# EAGLE design front (EAGLE 6.2)
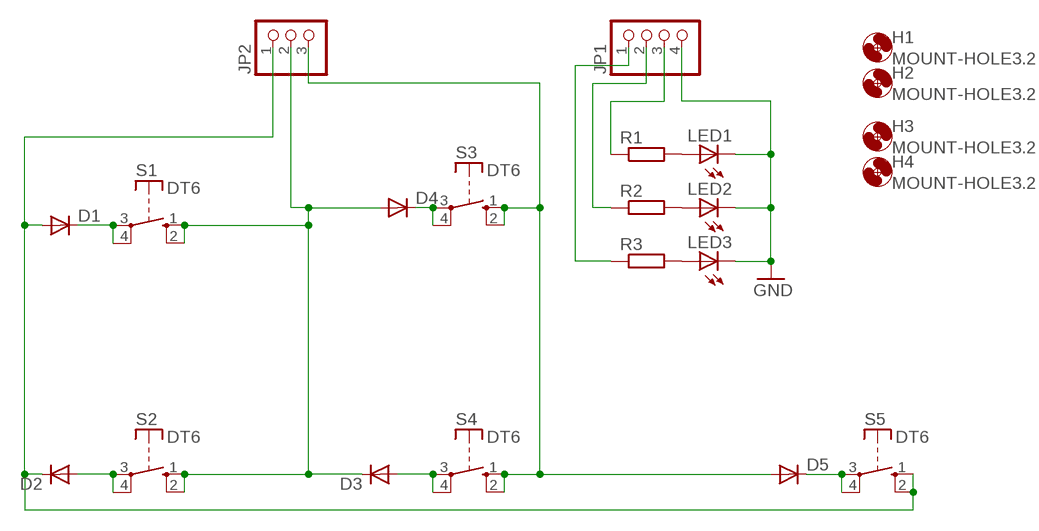
[diagram p0: schematic, sheet 1]

## Parts
D1  DIODE-MINIMELF  [MINIMELF]
D2  DIODE-MINIMELF  [MINIMELF]
D3  DIODE-MINIMELF  [MINIMELF]
D4  DIODE-MINIMELF  [MINIMELF]
D5  DIODE-MINIMELF  [MINIMELF]
H1  MOUNT-HOLE3.2  [3,2]
H2  MOUNT-HOLE3.2  [3,2]
H3  MOUNT-HOLE3.2  [3,2]
H4  MOUNT-HOLE3.2  [3,2]
JP1  PINHD-1X4  [1X04]
JP2  PINHD-1X3  [1X03]
LED1  LED3MM  [LED3MM]
LED2  LED3MM  [LED3MM]
LED3  LED3MM  [LED3MM]
R1  R-EU_R0805  [R0805]
R2  R-EU_R0805  [R0805]
R3  R-EU_R0805  [R0805]
S1  DT6  [DT6]
S2  DT6  [DT6]
S3  DT6  [DT6]
S4  DT6  [DT6]
S5  DT6  [DT6]

## Nets
GND: JP1.4 LED1.K(C) LED2.K(C) LED3.K(C)
N$1: LED1.A R1.2
N$2: LED2.A R2.2
N$3: LED3.A R3.2
N$4: JP1.3 R1.1
N$5: JP1.2 R2.1
N$6: JP1.1 R3.1
N$8: D1.C S1.3(P) S1.4(P)
N$9: D2.A S2.3(P) S2.4(P)
N$10: D4.C S3.3(P) S3.4(P)
N$11: D3.A S4.3(P) S4.4(P)
N$14: D3.C D4.A JP2.2 S1.1(S) S1.2(S) S2.1(S) S2.2(S)
N$15: D5.A JP2.3 S3.1(S) S3.2(S) S4.1(S) S4.2(S)
N$17: D1.A D2.C JP2.1 S5.1(S) S5.2(S)
N$18: D5.C S5.3(P) S5.4(P)

## Library data of the parts
D1-D5 = diode:DIODE-: DIODE
H1-H4 = holes:MOUNT-HOLE: MOUNTING HOLE with drill center marker
JP1 = pinhead:PINHD-1X4: PIN HEADER
JP2 = pinhead:PINHD-1X3: PIN HEADER
LED1-LED3 = led:LED: LED OSRAM: - CHIPLED LG R971, LG N971, LY N971, LG Q971, LY Q971, LO R971, LY R971 LH N974, LH R974 LS Q976, LO Q976, LY Q976 LO Q996 - Hyper CHIPLED LW Q18S LB Q993, LB Q99A, LB R99A - SideLED LS A670, LO A670, LY A670, LG A670, LP A670 LB A673, LV A673, LT A673, LW A673 LH A674 LY A675 LS A676, LA A676, LO A676, LY A676, LW A676 LS A679, LY A679, LG A679 - Hyper Micro SIDELED® LS Y876, LA Y876, LO Y876, LY Y876 LT Y87S - SmartLED LW L88C, LW L88S LB L89C, LB L89S, LG L890 LS L89K, LO L89K, LY L89K LS L896, LA L896, LO L896, LY L896 - TOPLED LS T670, LO T670, LY T670, LG T670, LP T670 LSG T670, LSP T670, LSY T670, LOP T670, LYG T670 LG T671, LOG T671, LSG T671 LB T673, LV T673, LT T673, LW T673 LH T674 LS T676, LA T676, LO T676, LY T676, LB T676, LH T676, LSB T676, LW T676 LB T67C, LV T67C, LT T67C, LS T67K, LO T67K, LY T67K, LW E67C LS E67B, LA E67B, LO E67B, LY E67B, LB E67C, LV E67C, LT E67C LW T67C LS T679, LY T679, LG T679 LS T770, LO T770, LY T770, LG T770, LP T770 LB T773, LV T773, LT T773, LW T773 LH T774 LS E675, LA E675, LY E675, LS T675 LS T776, LA T776, LO T776, LY T776, LB T776 LHGB T686 LT T68C, LB T68C - Hyper Mini TOPLED® LB M676 - Mini TOPLED Santana® LG M470 LS M47K, LO M47K, LY M47K Source: http://www.osram.convergy.de LUXEON: - LUMILED® LXK2-PW12-R00, LXK2-PW12-S00, LXK2-PW14-U00, LXK2-PW14-V00 LXK2-PM12-R00, LXK2-PM12-S00, LXK2-PM14-U00 LXK2-PE12-Q00, LXK2-PE12-R00, LXK2-PE12-S00, LXK2-PE14-T00, LXK2-PE14-U00 LXK2-PB12-K00, LXK2-PB12-L00, LXK2-PB12-M00, LXK2-PB14-N00, LXK2-PB14-P00, LXK2-PB14-Q00 LXK2-PR12-L00, LXK2-PR12-M00, LXK2-PR14-Q00, LXK2-PR14-R00 LXK2-PD12-Q00, LXK2-PD12-R00, LXK2-PD12-S00 LXK2-PH12-R00, LXK2-PH12-S00 LXK2-PL12-P00, LXK2-PL12-Q00, LXK2-PL12-R00 Source: www.luxeon.com KINGBRIGHT: KA-3528ASYC Source: www.kingbright.com
R1-R3 = rcl:R-EU_: RESISTOR, European symbol
S1-S5 = switch-misc:DT: ITT SWITCH

## Board
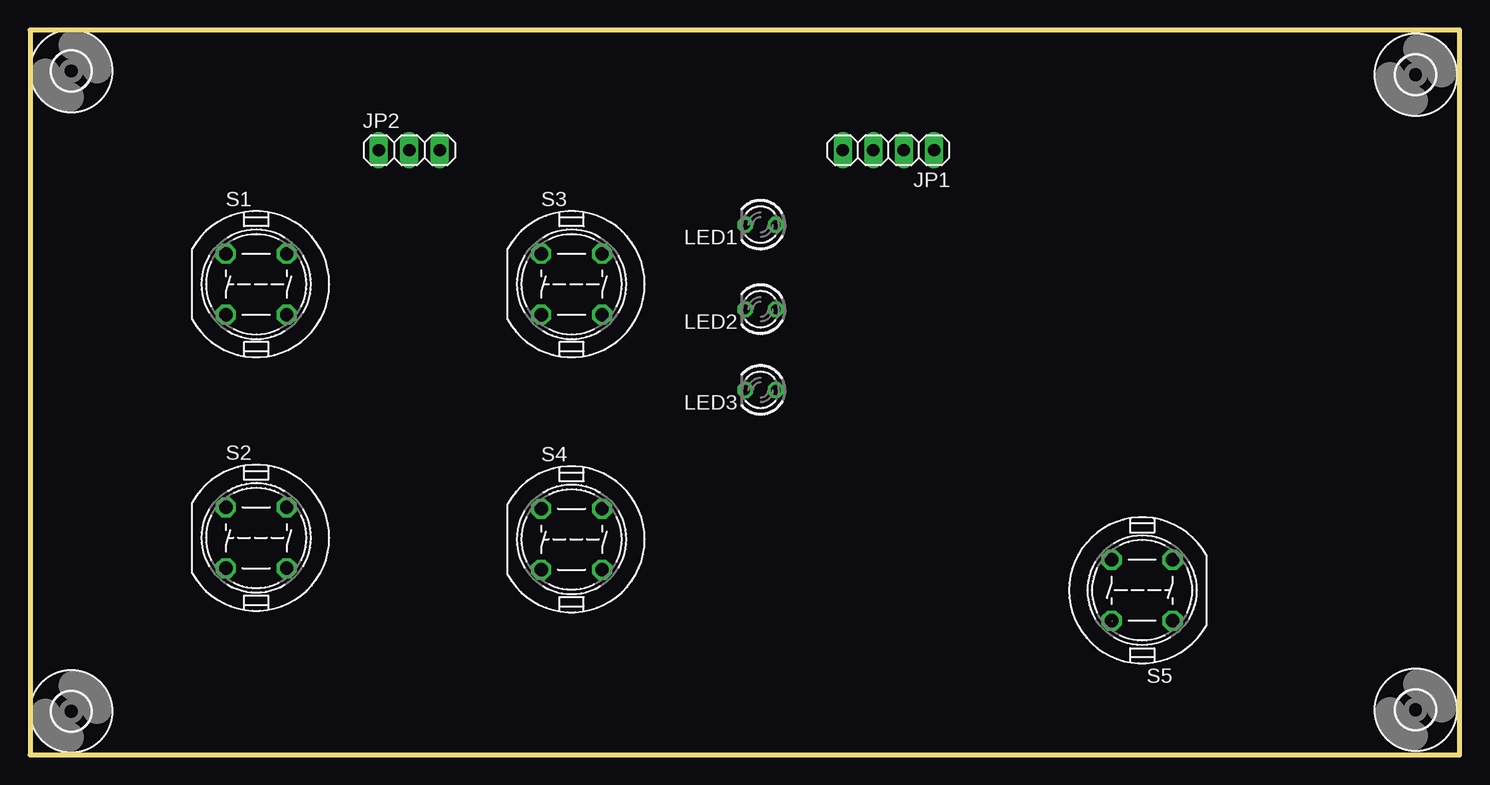
[diagram p1: board, top side]
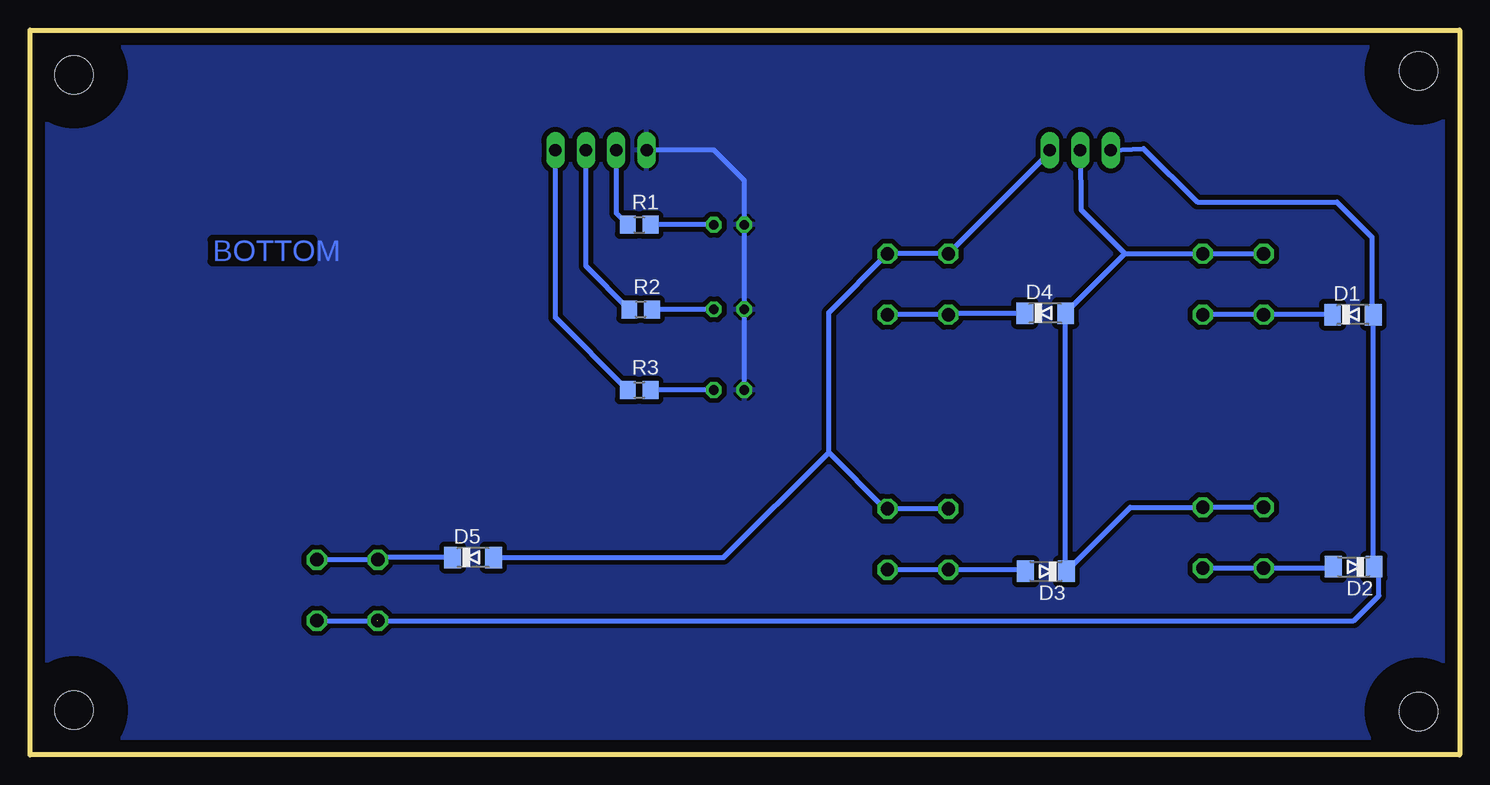
[diagram p2: board, bottom side, seen from below]

Size 119.17 x 60.44 mm. Coordinates in mm from the lower left corner, seen from the top.
Outline: 0,0 119.17,0 119.17,60.44 0,60.44 0,0
Copper layers (1*16): Top 0.035mm / dielectric 1.5mm / Bottom 0.035mm
Design rules "default": minimum track width 10mil, minimum drill 24mil, track to track 8mil, track to pad 8mil, pad to pad 8mil, via to via 8mil, smd to smd 8mil, copper to edge 40mil, drill to drill 8mil, minimum pad ring 10mil, minimum via ring 8mil, stop-mask expansion 4mil, vias tented up to drill 0mil, thermal gap 10mil

### Footprints (pad centres in the part's own frame; a part is rotated, then mirrored left to right if it is on the bottom)
MINIMELF = smd 1.4 x 1.8: A 1.7,0; C -1.7,0
3,2 = hole 3.2: 0,0
1X04 = drill 1.016 long: 1 -3.81,0; 2 -1.27,0; 3 1.27,0; 4 3.81,0
1X03 = drill 1.016 long: 1 -2.54,0; 2 0,0; 3 2.54,0
LED3MM = drill 0.813 octagon: A -1.27,0; K 1.27,0
R0805 = smd 1.3 x 1.5: 1 -0.95,0; 2 0.95,0
DT6 = drill 1.118 octagon: 1 -2.54,2.54; 2 2.54,2.54; 3 2.54,-2.54; 4 -2.54,-2.54

### Placement (x,y rotation side)
D1  8.89,36.7 0 bottom
D2  8.83,15.68 180 bottom
D3  34.48,15.3 180 bottom
D4  34.54,36.83 0 bottom
D5  82.23,16.45 0 bottom
H1  3.43,57.02 0 top
H2  3.43,3.62 0 top
H3  115.51,3.75 0 top
H4  115.51,56.71 0 top
JP1  71.56,50.42 180 top
JP2  31.62,50.42 0 top
LED1  60.9,44.2 180 top
LED2  60.9,37.15 180 top
LED3  60.9,30.42 180 top
R1  68.39,44.2 0 bottom
R2  68.26,37.15 0 bottom
R3  68.39,30.42 0 bottom
S1  18.86,39.24 0 top
S2  18.86,18.1 0 top
S3  45.15,39.24 0 top
S4  45.15,17.97 0 top
S5  92.71,13.72 180 top

### Tracks (layer width: path | path; a pad name or v marks a point on that pad's centre or on a via)
GND
  Bottom 0.406: LED3.K LED2.K LED1.K 59.63,47.88 62.17,50.42 JP1.4
  pour Bottom (isolate 0.406): -2.92,63.75 122.43,62.86 121.54,-3.75 -3.81,-2.86
N$1
  Bottom 0.406: LED1.A R1.2
N$2
  Bottom 0.406: LED2.A R2.2
N$3
  Bottom 0.406: LED3.A R3.2
N$4
  Bottom 0.406: R1.1 70.29,45.15 JP1.3
N$5
  Bottom 0.406: R2.1 72.83,40.77 JP1.2
N$6
  Bottom 0.406: R3.1 75.37,36.45 JP1.1
N$8
  Bottom 0.406: D1.C S1.4 S1.3
N$9
  Bottom 0.406: D2.A 10.65,15.56 S2.4 S2.3
N$10
  Bottom 0.406: D4.C 42.48,36.83 S3.4 S3.3
N$11
  Bottom 0.406: S4.3 S4.4 36.31,15.43 D3.A
N$14
  Bottom 0.406: S2.1 S2.2 27.45,20.64 D3.C 32.84,15.37 D4.A 27.89,41.78 | 27.89,41.78 S1.2 S1.1 | JP2.2 31.56,45.45 27.89,41.78
N$15
  Bottom 0.406: S4.1 S4.2 47.88,20.51 52.58,25.21 | JP2.3 34.1,50.29 S3.1 S3.2 52.58,36.89 52.58,25.21 | D5.A 61.34,16.45 52.58,25.21
N$17  (1 unrouted)
  Bottom 0.406: JP2.1 26.35,50.55 21.84,46.1 10.22,46.1 7.3,43.18 7.3,36.82 D1.A 7.19,15.75 D2.C 6.73,15.29 6.73,13.27 8.83,11.18 S5.2 | S5.1 90.23,11.18 89.85,11.56
N$18
  Bottom 0.406: D5.C 89.98,16.45 S5.3 S5.4

### Text on the board
Bottom: BOTTOM